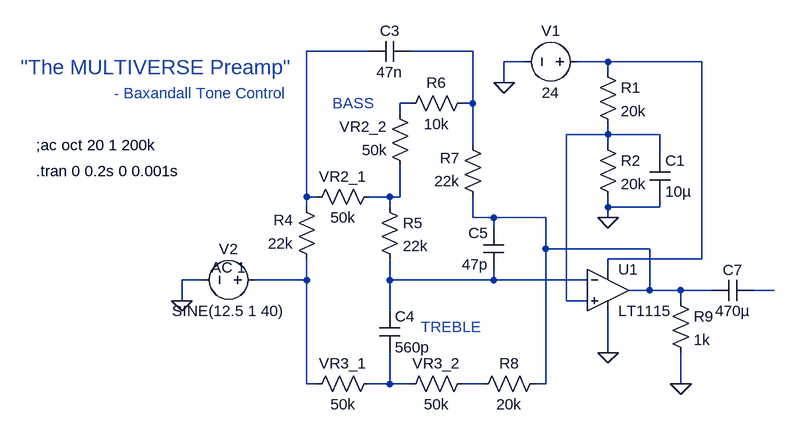
[diagram p0: schematic Baxandall Tone Control_NoPreOpAmp.asc]
Baxandall Tone Control_NoPreOpAmp.asc, the LTspice schematic file:
Version 4
SHEET 1 880 680
WIRE -80 -240 -176 -240
WIRE 80 -240 -16 -240
WIRE 160 -224 128 -224
WIRE 288 -224 240 -224
WIRE 432 -224 288 -224
WIRE 288 -208 288 -224
WIRE 128 -192 128 -224
WIRE -16 -160 -32 -160
WIRE 80 -160 80 -240
WIRE 80 -160 64 -160
WIRE -32 -144 -32 -160
WIRE 288 -112 288 -128
WIRE 288 -112 224 -112
WIRE 368 -112 288 -112
WIRE 80 -96 80 -160
WIRE 288 -96 288 -112
WIRE 368 -80 368 -112
WIRE -176 -16 -176 -240
WIRE -160 -16 -176 -16
WIRE -48 -16 -80 -16
WIRE -32 -16 -32 -64
WIRE -32 -16 -48 -16
WIRE -176 0 -176 -16
WIRE -48 0 -48 -16
WIRE 288 0 288 -16
WIRE 368 0 368 -16
WIRE 368 0 288 0
WIRE 80 16 80 -16
WIRE 112 16 80 16
WIRE 192 16 112 16
WIRE 288 16 288 0
WIRE 112 32 112 16
WIRE 192 64 192 16
WIRE 352 64 192 64
WIRE 432 80 432 -224
WIRE 432 80 288 80
WIRE 288 96 288 80
WIRE -336 112 -368 112
WIRE -176 112 -176 80
WIRE -176 112 -256 112
WIRE -48 112 -48 80
WIRE 112 112 112 96
WIRE 112 112 -48 112
WIRE 256 112 112 112
WIRE 352 128 352 64
WIRE 352 128 320 128
WIRE 400 128 352 128
WIRE 448 128 400 128
WIRE 544 128 512 128
WIRE -368 144 -368 112
WIRE 224 144 224 -112
WIRE 256 144 224 144
WIRE 400 144 400 128
WIRE -48 160 -48 112
WIRE 288 224 288 160
WIRE -176 272 -176 112
WIRE -160 272 -176 272
WIRE -48 272 -48 224
WIRE -48 272 -80 272
WIRE -16 272 -48 272
WIRE 96 272 64 272
WIRE 192 272 192 64
WIRE 192 272 176 272
WIRE 400 272 400 224
FLAG 128 -192 0
FLAG 288 224 0
FLAG 400 272 0
FLAG -368 144 0
FLAG 288 16 0
SYMBOL voltage 256 -224 R90
WINDOW 0 -32 56 VBottom 2
WINDOW 3 32 56 VTop 2
WINDOW 123 0 0 Left 2
WINDOW 39 0 0 Left 2
SYMATTR InstName V1
SYMATTR Value 24
SYMBOL res -16 -48 R180
WINDOW 0 36 76 Left 2
WINDOW 3 36 40 Left 2
SYMATTR InstName VR2_2
SYMATTR Value 50k
SYMBOL res 80 256 R90
WINDOW 0 0 56 VBottom 2
WINDOW 3 32 56 VTop 2
SYMATTR InstName VR3_2
SYMATTR Value 50k
SYMBOL res -64 256 R90
WINDOW 0 0 56 VBottom 2
WINDOW 3 32 56 VTop 2
SYMATTR InstName VR3_1
SYMATTR Value 50k
SYMBOL res -64 -32 R90
WINDOW 0 0 56 VBottom 2
WINDOW 3 32 56 VTop 2
SYMATTR InstName VR2_1
SYMATTR Value 50k
SYMBOL cap -64 160 R0
SYMATTR InstName C4
SYMATTR Value 560p
SYMATTR SpiceLine Rser=10m
SYMBOL res -64 -16 R0
SYMATTR InstName R5
SYMATTR Value 22k
SYMBOL res 96 0 R180
WINDOW 0 36 76 Left 2
WINDOW 3 36 40 Left 2
SYMATTR InstName R7
SYMATTR Value 22k
SYMBOL res -160 96 R180
WINDOW 0 36 76 Left 2
WINDOW 3 36 40 Left 2
SYMATTR InstName R4
SYMATTR Value 22k
SYMBOL cap -16 -256 R90
WINDOW 0 0 32 VBottom 2
WINDOW 3 32 32 VTop 2
SYMATTR InstName C3
SYMATTR Value 47n
SYMATTR SpiceLine Rser=10m
SYMBOL Opamps\\LT1115 288 64 R0
SYMATTR InstName U1
SYMBOL cap 128 96 R180
WINDOW 0 24 56 Left 2
WINDOW 3 24 8 Left 2
SYMATTR InstName C5
SYMATTR Value 47p
SYMBOL res 384 128 R0
SYMATTR InstName R9
SYMATTR Value 1k
SYMBOL res 192 256 R90
WINDOW 0 0 56 VBottom 2
WINDOW 3 32 56 VTop 2
SYMATTR InstName R8
SYMATTR Value 20k
SYMBOL res 80 -176 R90
WINDOW 0 0 56 VBottom 2
WINDOW 3 32 56 VTop 2
SYMATTR InstName R6
SYMATTR Value 10k
SYMBOL voltage -240 112 R90
WINDOW 0 -32 56 VBottom 2
WINDOW 3 32 56 VTop 2
WINDOW 123 -4 56 VBottom 2
WINDOW 39 0 0 Left 2
SYMATTR InstName V2
SYMATTR Value SINE(12.5 1 40)
SYMATTR Value2 AC 1
SYMBOL cap 512 112 R90
WINDOW 0 0 32 VBottom 2
WINDOW 3 32 32 VTop 2
SYMATTR InstName C7
SYMATTR Value 470µ
SYMBOL res 272 -224 R0
SYMATTR InstName R1
SYMATTR Value 20k
SYMBOL res 272 -112 R0
SYMATTR InstName R2
SYMATTR Value 20k
SYMBOL cap 352 -80 R0
SYMATTR InstName C1
SYMATTR Value 10µ
TEXT -592 -96 Left 2 !;ac oct 20 1 200k
TEXT -136 -160 Left 2 ;BASS
TEXT 0 184 Left 2 ;TREBLE
TEXT -592 -56 Left 2 !.tran 0 0.2s 0 0.001s
TEXT -616 -216 Left 3 ;"The MULTIVERSE Preamp"
TEXT -472 -176 Left 2 ;- Baxandall Tone Control

The netlist it stands for:
* Baxandall Tone Control_NoPreOpAmp.asc
V1 N003 0 24
R§VR2_2 N006 N004 50k
R§VR3_2 N012 N011 50k
R§VR3_1 N011 N008 50k
R§VR2_1 N006 N001 50k
C4 N009 N011 560p Rser=10m
R5 N006 N009 22k
R7 N007 N002 22k
R4 N008 N001 22k
C3 N002 N001 47n Rser=10m
XU1 N005 N009 N003 0 N007 LT1028  ; LT1115, pins In+ In- V+ V- OUT
C5 N009 N007 47p
R9 N007 0 1k
R8 N007 N012 20k
R6 N002 N004 10k
V2 N008 0 SINE(12.5 1 40) AC 1
C7 N010 N007 470µ
R1 N003 N005 20k
R2 N005 0 20k
C1 N005 0 10µ
;ac oct 20 1 200k
* BASS
* TREBLE
.tran 0 0.2s 0 0.001s
* "The MULTIVERSE Preamp"
* - Baxandall Tone Control
.lib LTC.lib
.backanno
.end